# Altium schematic sheet Velvet_Controller_v1.1_2022.SchDoc
size A4
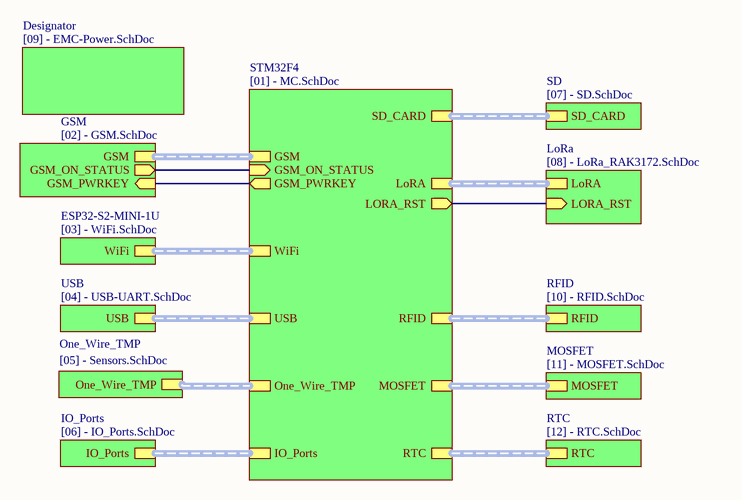
[diagram p0: Velvet_Controller_v1.1_2022.SchDoc]

## Sub-sheets
Designator = [09] - EMC-Power.SchDoc: no entries
ESP32-S2-MINI-1U = [03] - WiFi.SchDoc: WiFi (harness WiFi)
GSM = [02] - GSM.SchDoc: GSM (harness GSM), GSM_ON_STATUS (out), GSM_PWRKEY (in)
IO_Ports = [06] - IO_Ports.SchDoc: IO_Ports (harness IO_Ports)
LoRa = [08] - LoRa_RAK3172.SchDoc: LoRA (harness LoRa_UART), LORA_RST (in)
MOSFET = [11] - MOSFET.SchDoc: MOSFET (harness MOSFET)
One_Wire_TMP = [05] - Sensors.SchDoc: One_Wire_TMP (harness One_Wire_TMP)
RFID = [10] - RFID.SchDoc: RFID (harness RFID)
RTC = [12] - RTC.SchDoc: RTC (harness RTC)
SD = [07] - SD.SchDoc: SD_CARD (harness SD_CARD)
STM32F4 = [01] - MC.SchDoc: RFID (harness RFID), USB (harness USB), LoRA (harness LoRa_UART), WiFi (harness WiFi), SD_CARD (harness SD_CARD), GSM (harness GSM), One_Wire_TMP (harness One_Wire_TMP), IO_Ports (harness IO_Ports), RTC (harness RTC), MOSFET (harness MOSFET), LORA_RST (out), GSM_ON_STATUS (in), GSM_PWRKEY (out)
USB = [04] - USB-UART.SchDoc: USB (harness USB)

## Nets
(unnamed): sheet STM32F4/LORA_RST, sheet LoRa/LORA_RST
(unnamed): sheet STM32F4/GSM_ON_STATUS, sheet GSM/GSM_ON_STATUS
(unnamed): sheet STM32F4/GSM_PWRKEY, sheet GSM/GSM_PWRKEY

## Buses and harness runs
harness sheet ESP32-S2-MINI-1U/WiFi = sheet STM32F4/WiFi
harness sheet GSM/GSM = sheet STM32F4/GSM
harness sheet IO_Ports/IO_Ports = sheet STM32F4/IO_Ports
harness sheet LoRa/LoRA = sheet STM32F4/LoRA
harness sheet MOSFET/MOSFET = sheet STM32F4/MOSFET
harness sheet One_Wire_TMP/One_Wire_TMP = sheet STM32F4/One_Wire_TMP
harness sheet RFID/RFID = sheet STM32F4/RFID
harness sheet RTC/RTC = sheet STM32F4/RTC
harness sheet SD/SD_CARD = sheet STM32F4/SD_CARD
harness sheet STM32F4/USB = sheet USB/USB

## Notes on the sheet
- Title
- Size:
- Date:
- A4
- Number:
- Time:
- Revision:
- Sheet
- of
- File: